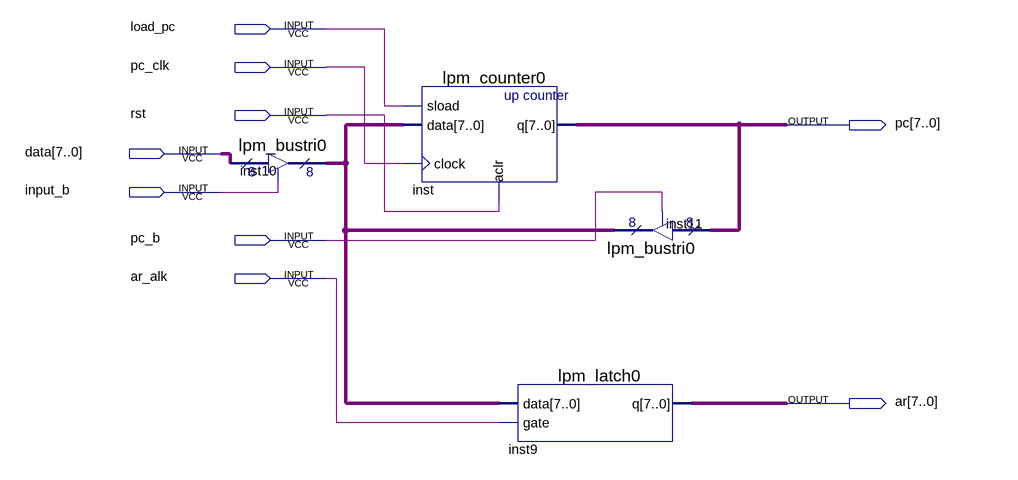
[diagram p0: schematic sheet]
// Quartus schematic Block1.bdf as structural Verilog: 4 symbols, 9 pins
module Block1 (
  input  load_pc,
  input  pc_clk,
  input  rst,
  input  [7:0] data,
  input  input_b,
  input  pc_b,
  input  ar_alk,
  output [7:0] pc,
  output [7:0] ar
);

  wire [7:0] inst10_tridata;

  lpm_bustri0 inst10 (.enabledt(input_b), .data(data), .tridata(inst10_tridata));
  lpm_counter0 inst (.sload(load_pc), .data(inst10_tridata), .clock(pc_clk), .aclr(rst), .q(pc));
  lpm_latch0 inst9 (.data(inst10_tridata), .gate(ar_alk), .q(ar));
  lpm_bustri0 inst11 (.enabledt(pc_b), .data(pc), .tridata(inst10_tridata));
endmodule
